# EAGLE schematic max636 (EAGLE 7.1.0)
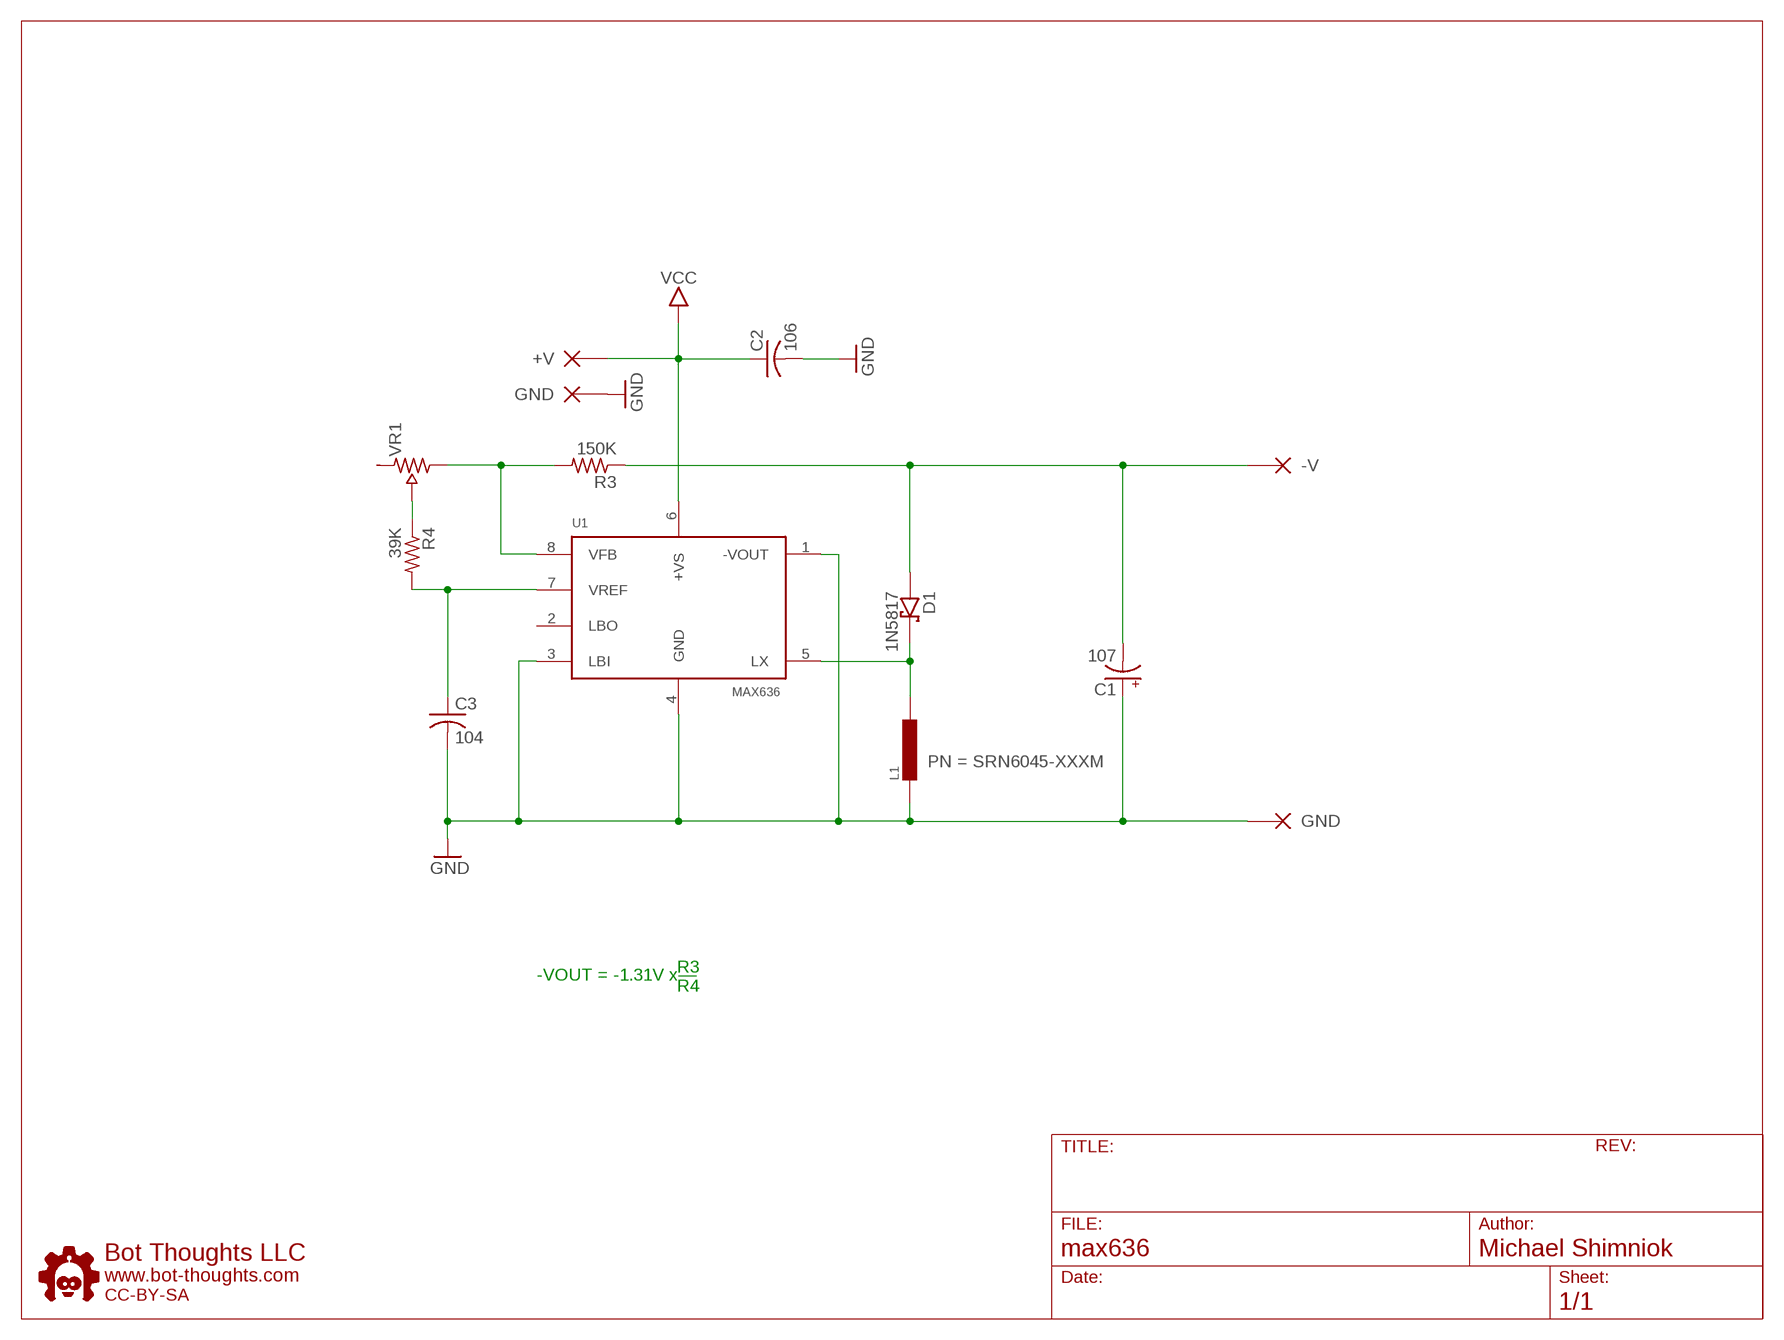
[diagram p0: schematic, sheet 1]

## Parts
C1  107  CPOL_SMC_B  [SMC_B]
C2  106  C-0603  [0603]
C3  104  C-0603  [0603]
D1  1N5817  SCHOTTKY-DIODE-B5817WS-TP  [SOD-323]
J1  +V  PINHEAD-1  [1X01-S]
J2  -V  PINHEAD-1  [1X01-S]
J3  GND  PINHEAD-1  [1X01-S]
J4  GND  PINHEAD-1  [1X01-S]
L1  INDUCTOR-VLS6045EX  [VLS6045EX]
R3  150K  R0603  [0603]
R4  39K  R0603  [0603]
U1  MAX636  MAX636DIP  [PDIP8]
U$1  BTLOGO-LOGO-SM  [BTLOGOS]
VR1  TRIM-PV36W  [PV36W]

## Nets
GND: C1.+ C2.2(-) C3.2(-) J3.1(P) J4.1(P) L1.1 U1.1(-VOUT) U1.3(LBI) U1.4(GND)
N$1: D1.C L1.2 U1.5(LX)
N$2: R3.2 U1.8(VFB) VR1.1(A)
N$3: C1.- D1.A J2.1(P) R3.1
N$5: R4.1 VR1.2(WIPER)
N$6: C3.1(+) R4.2 U1.7(VREF)
VCC: C2.1(+) J1.1(P) U1.6(+VS)
Unconnected: U1.2(LBO) VR1.3(B)

## Notes on the sheet
- -VOUT = -1.31V x
- R3
  R4

## Library data of the parts
C1 = bt_rcl:CPOL: Capacitor, Polarized, American symbol
C2 C3 = bt_rcl:C: Capacitor, non-polarized, American symbol
D1 = bt_diode:SCHOTTKY-DIODE: Schottky Diode
J1-J4 = bt_electromech:PINHEAD-1: PIN HEADER 1x1, Small Symbol 1x1 pin header with small symbol makes it easier to build breakout boards
L1 = bt_inductor:INDUCTOR: Generic Inductor; PN: SRN6045-XXXM
R3 R4 = bt_rcl:R: Resistor, American symbol
U1 = bt_regulator:MAX636: MAX635, MAX636, MAX637 Inverting Switching Regulator The MAX635/MAX636/MAX637 inverting switching regulators are designed for minimum component DC-DC conversion in the 5mw to 500mW range. datasheet.pdf <https://www.analog.com/media/en/technical-documentation/data-sheets/max635-max637.pdf>
U$1 = bt:BTLOGO: Bot Thoughts Logo
VR1 = bt_electromech:TRIM-: POTENTIOMETER (TRIM, TRIMPOT, POT) 3-pin trim potentiometer in various packages